# EAGLE design RS9113-XXX-X1X Breakout (EAGLE 6.6.0)
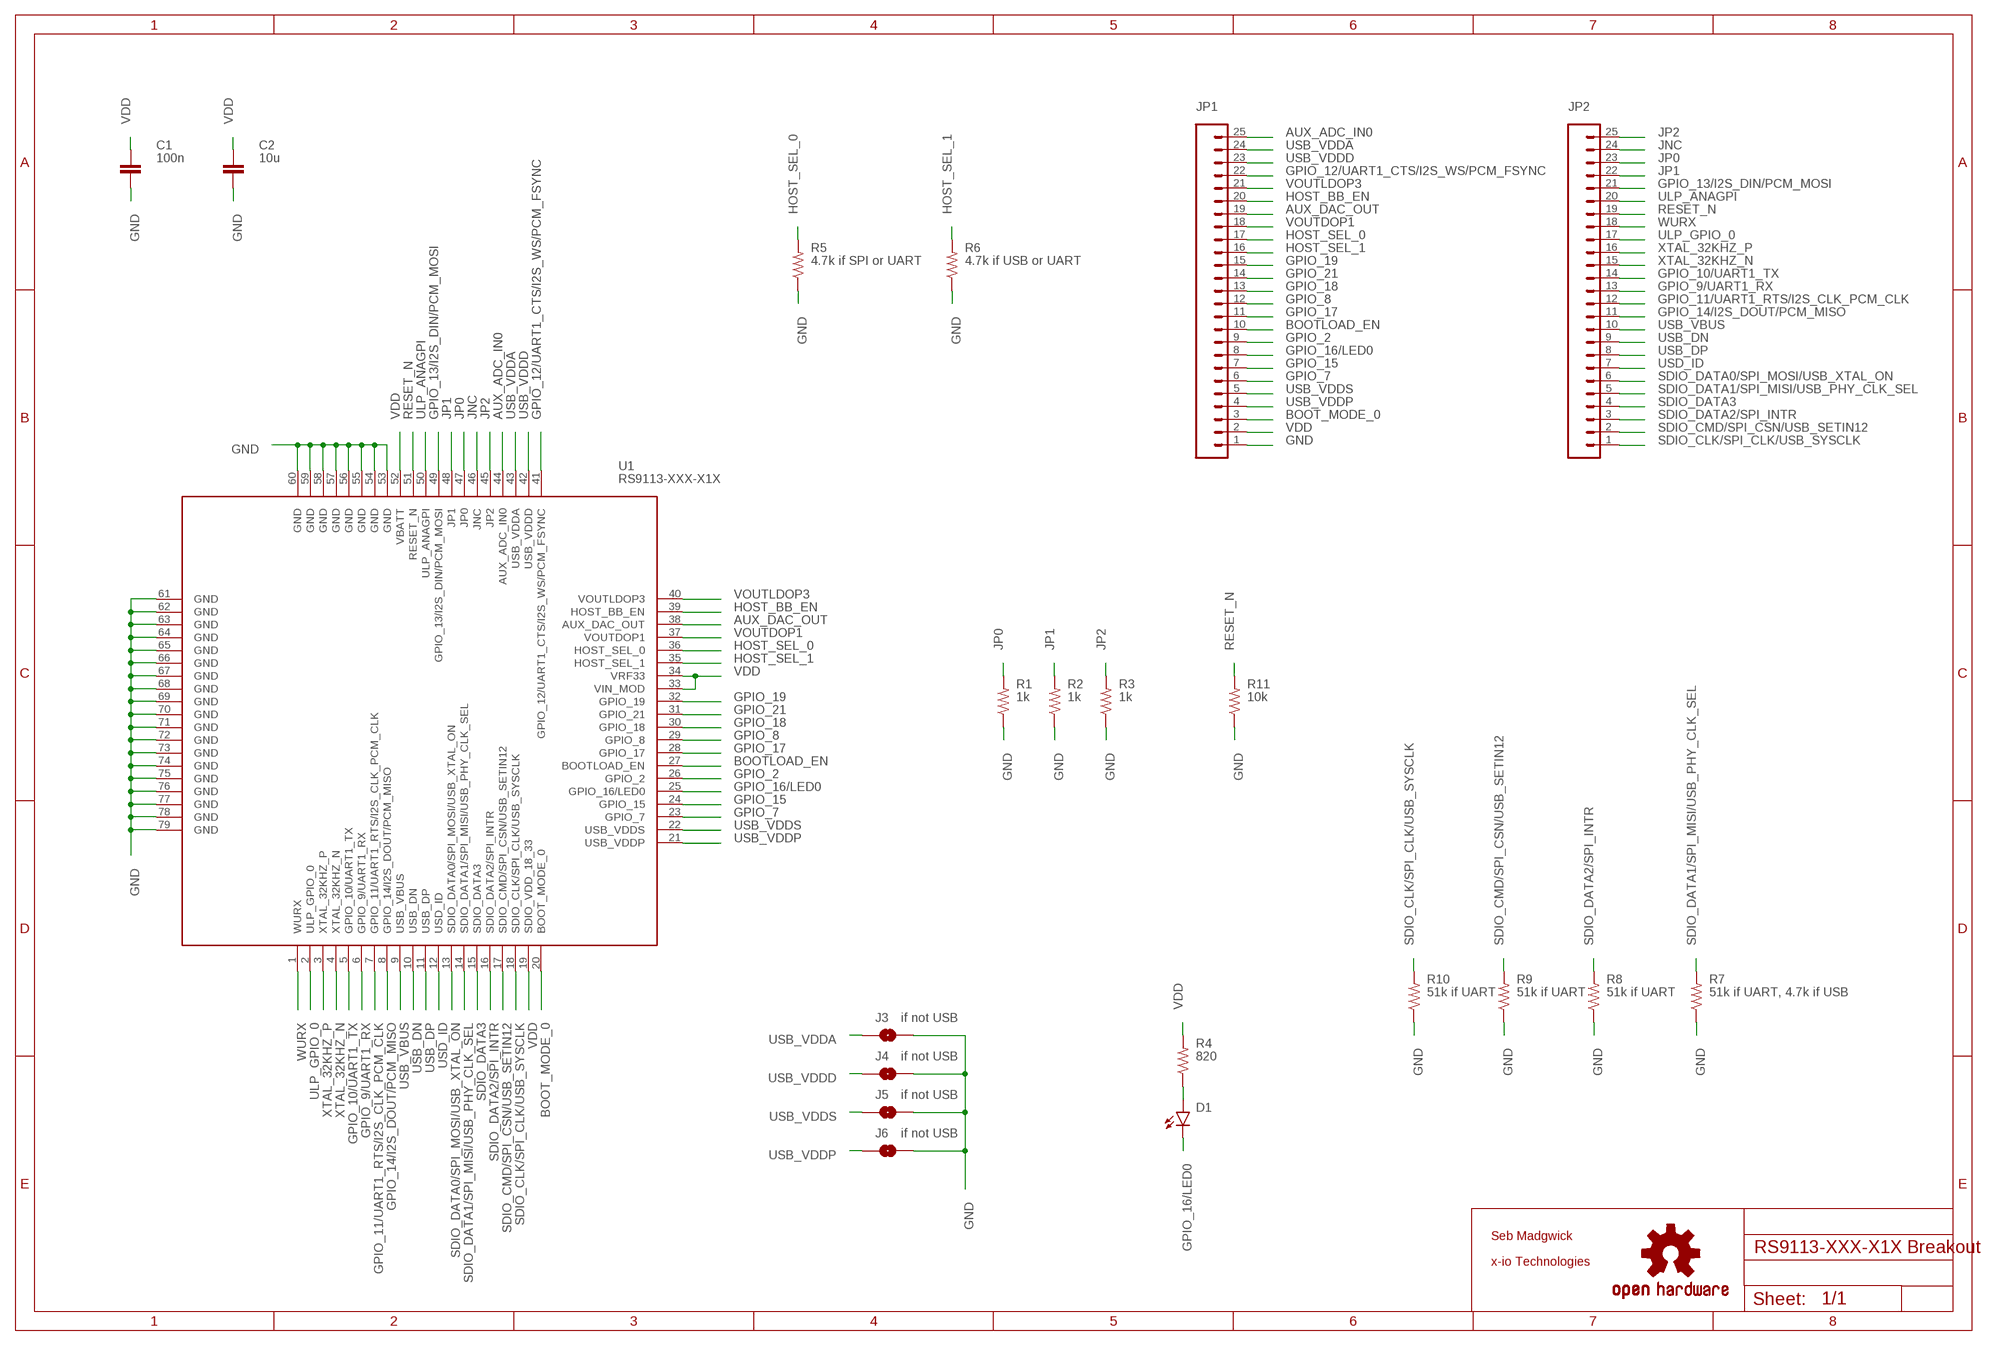
[diagram p0: schematic, sheet 1]

## Parts
C1  100n  CAP0603-CAP  [0603-CAP]
C2  10u  CAP0603-CAP  [0603-CAP]
D1  GREEN  LED-GREEN0603  [LED-0603]
J3  if not USB  SOLDERJUMPERNO  [SJ_2S-NO]
J4  if not USB  SOLDERJUMPERNO  [SJ_2S-NO]
J5  if not USB  SOLDERJUMPERNO  [SJ_2S-NO]
J6  if not USB  SOLDERJUMPERNO  [SJ_2S-NO]
JP1  M25PTH  [1X25]
JP2  M25PTH  [1X25]
LOGO1  OSHW-LOGOS  [OSHW-LOGO-S]
R1  1k  RESISTOR0603  [0603-RES]
R2  1k  RESISTOR0603  [0603-RES]
R3  1k  RESISTOR0603  [0603-RES]
R4  820  RESISTOR0603  [0603-RES]
R5  4.7k if SPI or UART  RESISTOR0603  [0603-RES]
R6  4.7k if USB or UART  RESISTOR0603  [0603-RES]
R7  51k if UART, 4.7k if USB  RESISTOR0603  [0603-RES]
R8  51k if UART  RESISTOR0603  [0603-RES]
R9  51k if UART  RESISTOR0603  [0603-RES]
R10  51k if UART  RESISTOR0603  [0603-RES]
R11  10k  RESISTOR0603  [0603-RES]
U1  RS9113-XXX-X1X  [RS9113-XXX-X1X]

## Nets
AUX_ADC_IN0: JP1.25 U1.44(AUX_ADC_IN0)
AUX_DAC_OUT: JP1.19 U1.38(AUX_DAC_OUT)
BOOT_MODE_0: JP1.3 U1.20(BOOT_MODE_0)
BOOTLOAD_EN: JP1.10 U1.27(BOOTLOAD_EN)
GND: C1.2 C2.2 J3.1 J4.1 J5.1 J6.1 JP1.1 R1.1 R2.1 R3.1 R5.1 R6.1 R7.1 R8.1 R9.1 R10.1 R11.1 U1.53(GND) U1.54(GND) U1.55(GND) U1.56(GND) U1.57(GND) U1.58(GND) U1.59(GND) U1.60(GND) U1.61(GND) U1.62(GND) U1.63(GND) U1.64(GND) U1.65(GND) U1.66(GND) U1.67(GND) U1.68(GND) U1.69(GND) U1.70(GND) U1.71(GND) U1.72(GND) U1.73(GND) U1.74(GND) U1.75(GND) U1.76(GND) U1.77(GND) U1.78(GND) U1.79(GND)
GPIO_2: JP1.9 U1.26(GPIO_2)
GPIO_7: JP1.6 U1.23(GPIO_7)
GPIO_8: JP1.12 U1.29(GPIO_8)
GPIO_9/UART1_RX: JP2.13 U1.6(GPIO_9/UART1_RX)
GPIO_10/UART1_TX: JP2.14 U1.5(GPIO_10/UART1_TX)
GPIO_11/UART1_RTS/I2S_CLK_PCM_CLK: JP2.12 U1.7(GPIO_11/UART1_RTS/I2S_CLK_PCM_CLK)
GPIO_12/UART1_CTS/I2S_WS/PCM_FSYNC: JP1.22 U1.41(GPIO_12/UART1_CTS/I2S_WS/PCM_FSYNC)
GPIO_13/I2S_DIN/PCM_MOSI: JP2.21 U1.49(GPIO_13/I2S_DIN/PCM_MOSI)
GPIO_14/I2S_DOUT/PCM_MISO: JP2.11 U1.8(GPIO_14/I2S_DOUT/PCM_MISO)
GPIO_15: JP1.7 U1.24(GPIO_15)
GPIO_16/LED0: D1.C JP1.8 U1.25(GPIO_16/LED0)
GPIO_17: JP1.11 U1.28(GPIO_17)
GPIO_18: JP1.13 U1.30(GPIO_18)
GPIO_19: JP1.15 U1.32(GPIO_19)
GPIO_21: JP1.14 U1.31(GPIO_21)
HOST_BB_EN: JP1.20 U1.39(HOST_BB_EN)
HOST_SEL_0: JP1.17 R5.2 U1.36(HOST_SEL_0)
HOST_SEL_1: JP1.16 R6.2 U1.35(HOST_SEL_1)
JNC: JP2.24 U1.46(JNC)
JP0: JP2.23 R1.2 U1.47(JP0)
JP1: JP2.22 R2.2 U1.48(JP1)
JP2: JP2.25 R3.2 U1.45(JP2)
N$1: D1.A R4.1
RESET_N: JP2.19 R11.2 U1.51(RESET_N)
SDIO_CLK/SPI_CLK/USB_SYSCLK: JP2.1 R10.2 U1.18(SDIO_CLK/SPI_CLK/USB_SYSCLK)
SDIO_CMD/SPI_CSN/USB_SETIN12: JP2.2 R9.2 U1.17(SDIO_CMD/SPI_CSN/USB_SETIN12)
SDIO_DATA0/SPI_MOSI/USB_XTAL_ON: JP2.6 U1.13(SDIO_DATA0/SPI_MOSI/USB_XTAL_ON)
SDIO_DATA1/SPI_MISI/USB_PHY_CLK_SEL: JP2.5 R7.2 U1.14(SDIO_DATA1/SPI_MISI/USB_PHY_CLK_SEL)
SDIO_DATA2/SPI_INTR: JP2.3 R8.2 U1.16(SDIO_DATA2/SPI_INTR)
SDIO_DATA3: JP2.4 U1.15(SDIO_DATA3)
ULP_ANAGPI: JP2.20 U1.50(ULP_ANAGPI)
ULP_GPIO_0: JP2.17 U1.2(ULP_GPIO_0)
USB_DN: JP2.9 U1.10(USB_DN)
USB_DP: JP2.8 U1.11(USB_DP)
USB_VBUS: JP2.10 U1.9(USB_VBUS)
USB_VDDA: J3.2 JP1.24 U1.43(USB_VDDA)
USB_VDDD: J4.2 JP1.23 U1.42(USB_VDDD)
USB_VDDP: J6.2 JP1.4 U1.21(USB_VDDP)
USB_VDDS: J5.2 JP1.5 U1.22(USB_VDDS)
USD_ID: JP2.7 U1.12(USD_ID)
VDD: C1.1 C2.1 JP1.2 R4.2 U1.19(SDIO_VDD_18_33) U1.33(VIN_MOD) U1.34(VRF33) U1.52(VBATT)
VOUTDOP1: JP1.18 U1.37(VOUTDOP1)
VOUTLDOP3: JP1.21 U1.40(VOUTLDOP3)
WURX: JP2.18 U1.1(WURX)
XTAL_32KHZ_N: JP2.15 U1.4(XTAL_32KHZ_N)
XTAL_32KHZ_P: JP2.16 U1.3(XTAL_32KHZ_P)

## Notes on the sheet
- Seb Madgwick
- x-io Technologies

## Library data of the parts
C1 C2 = SparkFun-Capacitors:CAP: Capacitor Standard 0603 ceramic capacitor, and 0.1" leaded capacitor.
D1 = SparkFun-LED:LED-GREEN: Various green LEDs Green LEDs used in SFE Production 0603- DIO-00821 LARGE- DIO-00862 LILYPAD- DIO-09910; PROD_ID: DIO-00821
J3-J6 = SparkFun-Retired:SOLDERJUMPER: Solder Jumper Standard SMD solder jumper. Used to automate production. Two varients : Normally Open and Normally Closed are the same, but have different paste layers. NC will have a large amount of paste and should jumper during reflow.
JP1 JP2 = SparkFun-Connectors:M25: 1x25 .1" header
LOGO1 = SparkFun-Aesthetics:OSHW-LOGO: Open Source Hardware Logo This logo indicates the piece of hardware it is found on incorporates a OSHW license and/or adheres to the definition of open source hardware found here: http://freedomdefined.org/OSHW
R1-R11 = SparkFun-Resistors:RESISTOR: Resistor Basic schematic elements and footprints for 0603, 1206, and PTH resistors.
U1 = x-io:RS9113-XXX-X1X

## Board
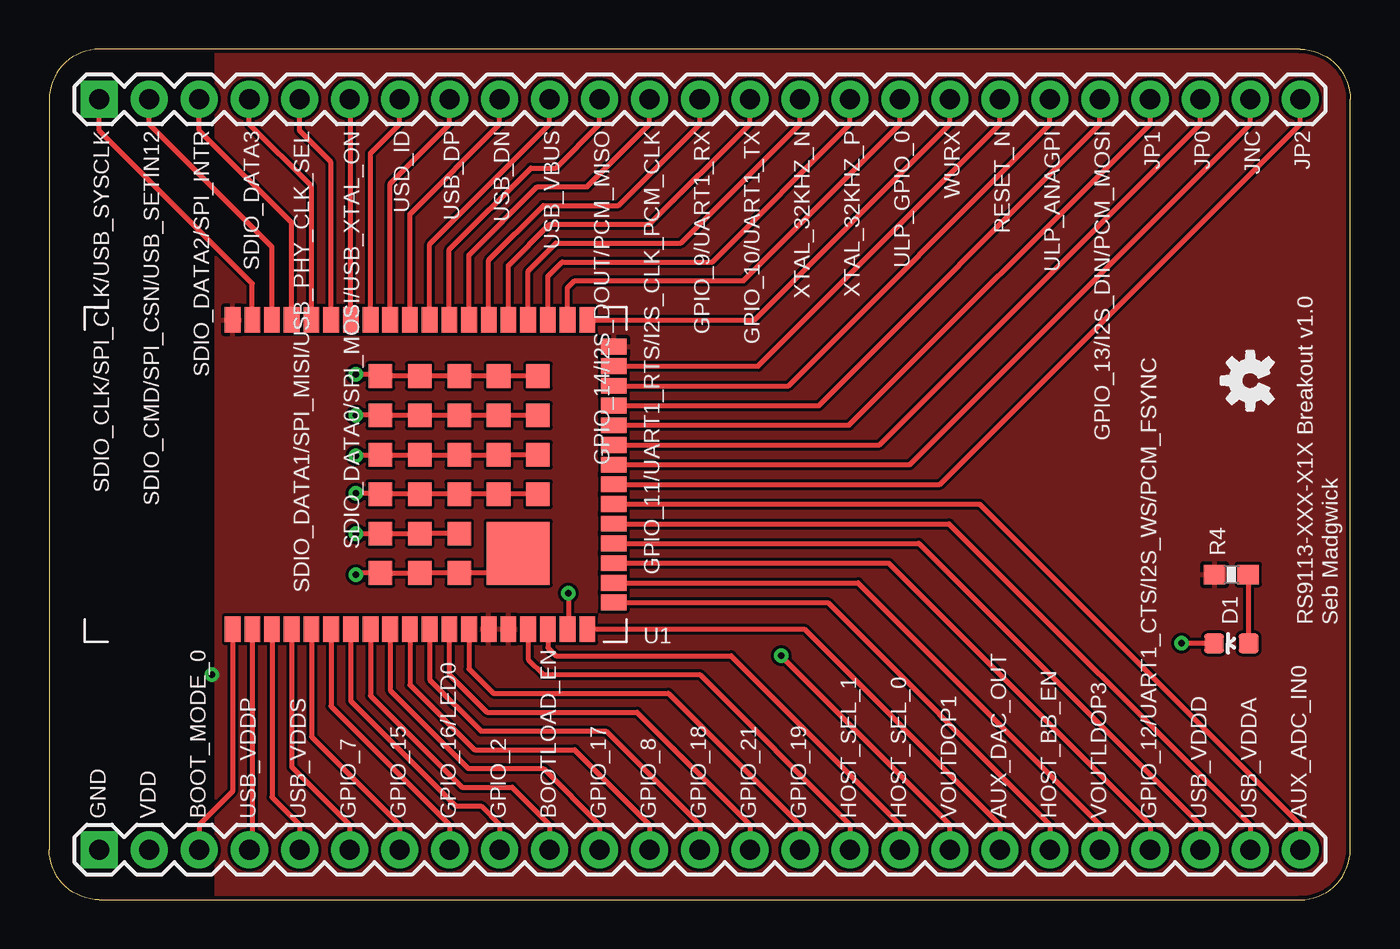
[diagram p1: board, top side]
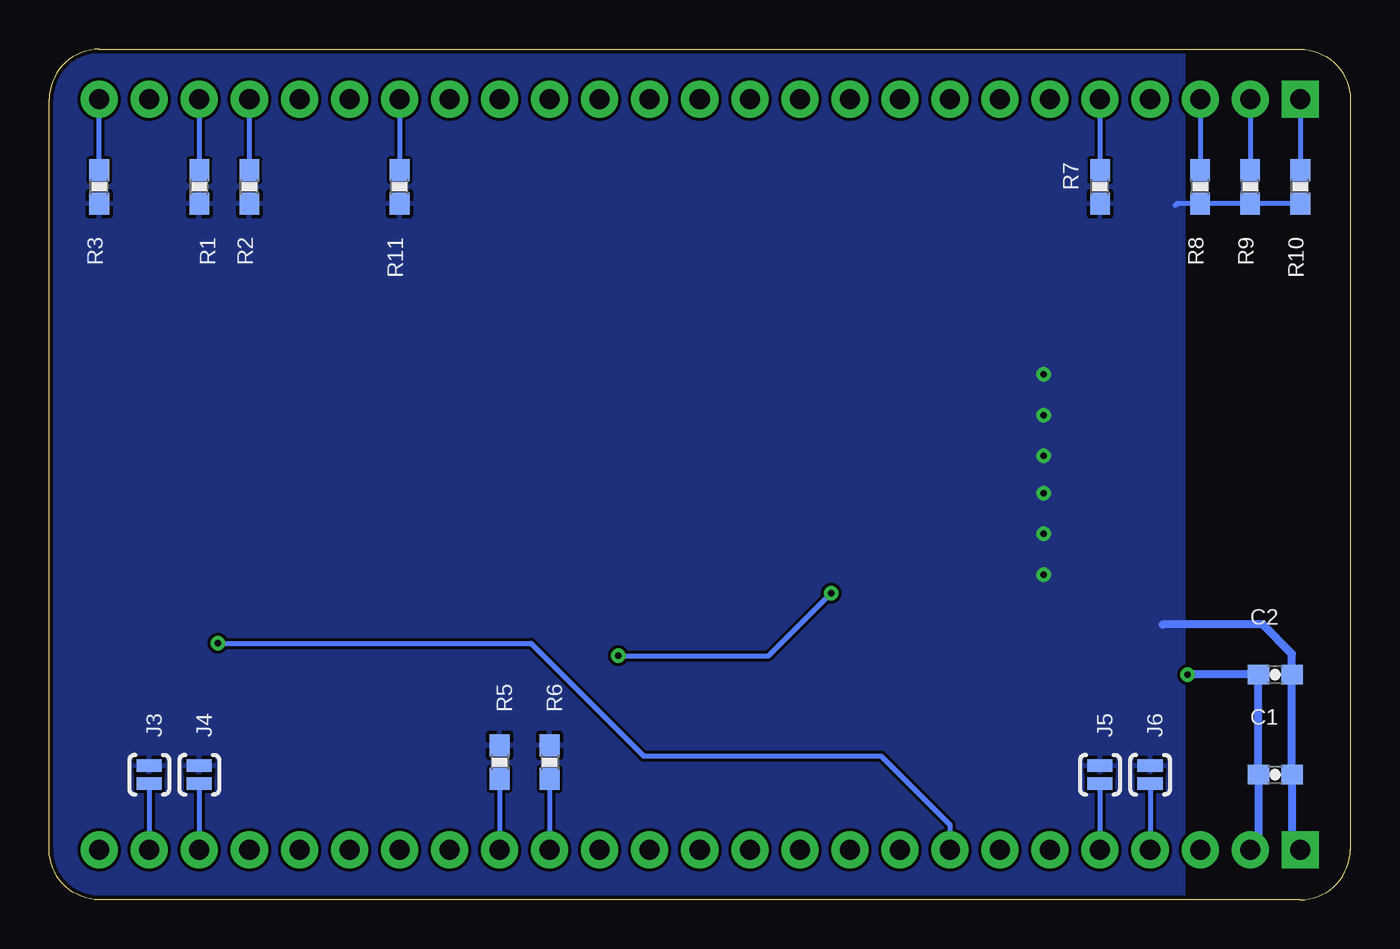
[diagram p2: board, bottom side, seen from below]

Size 66.04 x 43.18 mm. Coordinates in mm from the lower left corner, seen from the top.
Outline: 2.54,0 63.5,0 arc90 66.04,2.54 66.04,40.64 arc90 63.5,43.18 2.54,43.18 arc90 0,40.64 0,2.54 arc90 2.54,0
Copper layers (1*16): Top 0.035mm / dielectric 1.5mm / Bottom 0.035mm
Design rules "default *": minimum track width 6mil, minimum drill 13mil, track to track 6mil, track to pad 6mil, pad to pad 6mil, via to via 6mil, smd to smd 0.15mm, copper to edge 0.2mm, drill to drill 0.15mm, minimum pad ring 10mil, minimum via ring 8mil, stop-mask expansion 4mil, vias tented up to drill 1mm, thermal gap 0.195mm
tRestrict: area 0,0 to 8.3,43.2
bRestrict: area 0,0 to 8.3,43.2

### Footprints (pad centres in the part's own frame; a part is rotated, then mirrored left to right if it is on the bottom)
0603-CAP = smd 1.1 x 1: 1 -0.85,0; 2 0.85,0
LED-0603 = smd 1 x 1: A 0,-0.877; C 0,0.877
SJ_2S-NO = smd 0.635 x 1.27: 1 -0.45,0; 2 0.45,0
1X25 = drill 1.016 pad 1.88 square: 1 0,0 | drill 1.016 pad 1.88: 2 2.54,0; 3 5.08,0; 4 7.62,0; 5 10.16,0; 6 12.7,0; 7 15.24,0; 8 17.78,0; 9 20.32,0; 10 22.86,0; 11 25.4,0; 12 27.94,0; 13 30.48,0; 14 33.02,0; 15 35.56,0; 16 38.1,0; 17 40.64,0; 18 43.18,0; 19 45.72,0; 20 48.26,0; 21 50.8,0; 22 53.34,0; 23 55.88,0; 24 58.42,0; 25 60.96,0
0603-RES = smd 1.1 x 1: 1 -0.85,0; 2 0.85,0
RS9113-XXX-X1X = smd 1.3 x 0.8: 1 7.85,-11.75; 2 7.85,-10.75; 3 7.85,-9.75; 4 7.85,-8.75; 5 7.85,-7.75; 6 7.85,-6.75; 7 7.85,-5.75; 8 7.85,-4.75; 9 7.85,-3.75; 10 7.85,-2.75; 11 7.85,-1.75; 12 7.85,-0.75; 13 7.85,0.25; 14 7.85,1.25; 15 7.85,2.25; 16 7.85,3.25; 17 7.85,4.25; 18 7.85,5.25; 19 7.85,6.25; 20 -7.85,6.25; 21 -7.85,5.25; 22 -7.85,4.25; 23 -7.85,3.25; 24 -7.85,2.25; 25 -7.85,1.25; 26 -7.85,0.25; 27 -7.85,-0.75; 28 -7.85,-1.75; 29 -7.85,-2.75; 30 -7.85,-3.75; 31 -7.85,-4.75; 32 -7.85,-5.75; 33 -7.85,-6.75; 34 -7.85,-7.75; 35 -7.85,-8.75; 36 -7.85,-9.75; 37 -7.85,-10.75; 38 -7.85,-11.75 | smd 0.8 x 1.3: 39 -6.5,-13.1; 40 -5.5,-13.1; 41 -4.5,-13.1; 42 -3.5,-13.1; 43 -2.5,-13.1; 44 -1.5,-13.1; 45 -0.5,-13.1; 46 0.5,-13.1; 47 1.5,-13.1; 48 2.5,-13.1; 49 3.5,-13.1; 50 4.5,-13.1; 51 5.5,-13.1; 52 6.5,-13.1 | smd 3.2 x 3.2: 53 -4,-8.25 | smd 1.2 x 1.2: 54 -1,-9.25; 55 1,-9.25; 56 3,-9.25; 57 5,-9.25; 58 -1,-7.25; 59 1,-7.25; 60 3,-7.25; 61 5,-7.25; 62 -5,-5.25; 63 -3,-5.25; 64 -1,-5.25; 65 1,-5.25; 66 3,-5.25; 67 5,-5.25; 68 -5,-3.25; 69 -3,-3.25; 70 -1,-3.25; 71 1,-3.25; 72 3,-3.25; 73 5,-3.25; 74 -5,-1.25; 75 -3,-1.25; 76 -1,-1.25; 77 1,-1.25; 78 3,-1.25; 79 5,-1.25

### Placement (x,y rotation side)
C1  3.81,6.35 0 bottom
C2  3.81,11.43 0 bottom
D1  60.01,13.02 90 top
J3  60.96,6.35 270 bottom
J4  58.42,6.35 270 bottom
J5  12.7,6.35 270 bottom
J6  10.16,6.35 270 bottom
JP1  2.54,2.54 0 top
JP2  2.54,40.64 0 top
LOGO1  60.96,26.35 90 top
R1  58.42,36.2 90 bottom
R2  55.88,36.2 90 bottom
R3  63.5,36.2 90 bottom
R4  60.01,16.51 180 top
R5  43.18,6.99 270 bottom
R6  40.64,6.99 270 bottom
R7  12.7,36.2 90 bottom
R8  7.62,36.2 90 bottom
R9  5.08,36.2 90 bottom
R10  2.54,36.2 90 bottom
R11  48.26,36.2 90 bottom
U1  15.56,21.59 90 top

### Tracks (layer width: path | path; a pad name or v marks a point on that pad's centre or on a via)
AUX_ADC_IN0
  Top 0.254: U1.44 47.22,20.09 63.5,3.81 JP1.25
AUX_DAC_OUT
  Top 0.254: U1.38 38.33,13.74 48.26,3.81 JP1.19
BOOT_MODE_0
  Top 0.254: U1.20 9.31,5.5 7.62,3.81 JP1.3
BOOTLOAD_EN
  Top 0.254: U1.27 16.31,10.36 20.95,5.71 23.5,5.71 25.4,3.81 JP1.10
GND  (via drill 0.33)
  Top 0.254: v15.56,16.51 15.56,16.59 U1.74 U1.68 U1.62 22.81,16.59 U1.53 | U1.63 U1.69 U1.75 16.79,18.57 v15.56,18.57 | v15.56,20.64 16.76,20.64 U1.76 U1.70 U1.64 U1.58 U1.54 | U1.55 U1.59 U1.65 U1.71 U1.77 16.76,22.54 v15.56,22.54 | v15.56,24.61 16.79,24.61 U1.78 U1.72 U1.66 U1.60 U1.56 | U1.57 U1.61 U1.67 U1.73 U1.79 16.73,26.67 v15.56,26.67
  Bottom 0.254: R10.1 R9.1 R8.1 8.79,35.34 8.89,35.24
  Bottom 0.406: C1.2 2.96,2.96 JP1.1 | C1.2 C2.2 | C1.2 2.96,12.48 4.45,13.97 9.53,13.97
  pour Bottom: 0,43.18 66.04,43.18 66.04,0 0,0
GPIO_2
  Top 0.254: U1.26 15.31,10.09 20.64,4.76 21.91,4.76 22.86,3.81 JP1.9
GPIO_7
  Top 0.254: U1.23 12.31,6.74 15.24,3.81 JP1.6
GPIO_8
  Top 0.254: U1.29 18.31,10.9 21.59,7.62 26.67,7.62 30.48,3.81 JP1.12
GPIO_9/UART1_RX
  Top 0.254: U1.6 22.31,32.47 25.08,35.24 28.89,35.24 33.02,39.37 JP2.13
GPIO_10/UART1_TX
  Top 0.254: U1.5 23.31,32.2 25.4,34.29 30.48,34.29 35.56,39.37 JP2.14
GPIO_11/UART1_RTS/I2S_CLK_PCM_CLK
  Top 0.254: U1.7 21.31,32.74 24.77,36.2 27.3,36.2 30.48,39.37 JP2.12
GPIO_12/UART1_CTS/I2S_WS/PCM_FSYNC
  Top 0.254: U1.41 42.6,17.09 55.88,3.81 JP1.22
GPIO_13/I2S_DIN/PCM_MOSI
  Top 0.254: U1.49 39.06,25.09 53.34,39.37 JP2.21
GPIO_14/I2S_DOUT/PCM_MISO
  Top 0.254: U1.8 20.31,33.01 24.45,37.15 25.72,37.15 27.94,39.37 JP2.11
GPIO_15
  Top 0.254: U1.24 13.31,8.28 17.78,3.81 JP1.7
GPIO_16/LED0  (via drill 0.33)
  Top 0.254: JP1.8 20.32,3.81 14.31,9.82 U1.25 | D1.C v57.47,13.02
  Bottom 0.254: v57.47,13.02 41.59,13.02 35.88,7.3 23.81,7.3 20.32,3.81 JP1.8
GPIO_17
  Top 0.254: U1.28 17.31,10.63 21.27,6.67 25.08,6.67 27.94,3.81 JP1.11
GPIO_18
  Top 0.254: U1.30 19.31,11.17 21.91,8.57 28.26,8.57 33.02,3.81 JP1.13
GPIO_19
  Top 0.254: U1.32 21.31,11.71 22.54,10.48 31.43,10.48 38.1,3.81 JP1.15
GPIO_21
  Top 0.254: U1.31 20.31,11.44 22.23,9.53 29.84,9.53 35.56,3.81 JP1.14
HOST_BB_EN
  Top 0.254: U1.39 39.52,15.09 50.8,3.81 JP1.20
HOST_SEL_0
  Top 0.254: U1.36 25.31,12.79 25.72,12.38 34.61,12.38 43.18,3.81 JP1.17
  Bottom 0.254: R5.2 JP1.17
HOST_SEL_1
  Top 0.254: U1.35 24.31,12.21 25.08,11.43 33.02,11.43 40.64,3.81 JP1.16
  Bottom 0.254: R6.2 JP1.16
JNC
  Top 0.254: U1.46 43.68,22.09 60.96,39.37 JP2.24
JP0
  Top 0.254: U1.47 42.14,23.09 58.42,39.37 JP2.23
  Bottom 0.254: JP2.23 R1.2
JP1
  Top 0.254: U1.48 40.6,24.09 55.88,39.37 JP2.22
  Bottom 0.254: JP2.22 R2.2
JP2
  Top 0.254: U1.45 45.22,21.09 63.5,39.37 JP2.25
  Bottom 0.254: R3.2 JP2.25
N$1
  Top 0.254: R4.1 60.86,13.04 D1.A
RESET_N
  Top 0.254: U1.51 35.98,27.09 48.26,39.37 JP2.19
  Bottom 0.254: JP2.19 R11.2
SDIO_CLK/SPI_CLK/USB_SYSCLK
  Top 0.254: U1.18 10.31,31.29 2.54,39.05 JP2.1
  Bottom 0.254: JP2.1 R10.2
SDIO_CMD/SPI_CSN/USB_SETIN12
  Top 0.254: U1.17 11.31,33.14 5.08,39.37 JP2.2
  Bottom 0.254: JP2.2 R9.2
SDIO_DATA0/SPI_MOSI/USB_XTAL_ON
  Top 0.254: U1.13 15.31,40.57 JP2.6
SDIO_DATA1/SPI_MISI/USB_PHY_CLK_SEL
  Top 0.254: U1.14 14.31,37.45 12.7,39.05 JP2.5
  Bottom 0.254: JP2.5 R7.2
SDIO_DATA2/SPI_INTR
  Top 0.254: U1.16 12.31,34.37 7.62,39.05 JP2.3
  Bottom 0.254: JP2.3 R8.2
SDIO_DATA3
  Top 0.254: U1.15 13.31,36.22 10.16,39.37 JP2.4
ULP_ANAGPI
  Top 0.254: U1.50 37.52,26.09 50.8,39.37 JP2.20
ULP_GPIO_0
  Top 0.254: U1.2 26.31,31.07 26.67,31.43 35.24,31.43 43.18,39.37 JP2.17
USB_DN
  Top 0.254: U1.10 18.31,34.82 22.86,39.37 JP2.9
USB_DP
  Top 0.254: U1.11 17.31,36.36 20.32,39.37 JP2.8
USB_VBUS
  Top 0.254: U1.9 19.31,33.28 25.4,39.37 JP2.10
USB_VDDA
  Top 0.254: U1.43 45.68,19.09 60.96,3.81 JP1.24
  Bottom 0.254: J3.2 JP1.24
USB_VDDD
  Top 0.254: U1.42 44.14,18.09 58.42,3.81 JP1.23
  Bottom 0.254: J4.2 JP1.23
USB_VDDP
  Top 0.254: U1.21 10.31,2.69 JP1.4
  Bottom 0.254: J6.2 JP1.4
USB_VDDS
  Top 0.254: U1.22 11.31,5.2 12.7,3.81 JP1.5
  Bottom 0.254: J5.2 JP1.5
USD_ID
  Top 0.254: U1.12 16.31,37.9 17.78,39.37 JP2.7
VDD  (via drill 0.33)
  Bottom 0.406: JP1.2 4.66,2.96 C1.1 C2.1 v8.26,11.43
  pour Top: 0,43.18 66.04,43.18 66.04,0 0,0
VOUTDOP1  (via drill 0.33)
  Top 0.254: JP1.18 45.72,3.81 v37.15,12.38 | v26.35,15.56 26.35,13.79 U1.37
  Bottom 0.254: v37.15,12.38 29.53,12.38 v26.35,15.56
VOUTLDOP3
  Top 0.254: U1.40 41.06,16.09 53.34,3.81 JP1.21
WURX
  Top 0.254: U1.1 35.79,29.44 45.72,39.37 JP2.18
XTAL_32KHZ_N
  Top 0.254: U1.4 24.31,31.93 25.72,33.34 32.07,33.34 38.1,39.37 JP2.15
XTAL_32KHZ_P
  Top 0.254: U1.3 25.31,31.66 26.04,32.38 33.66,32.38 40.64,39.37 JP2.16

### Text on the board
_tsilk: SDIO_CLK/SPI_CLK/USB_SYSCLK | SDIO_CMD/SPI_CSN/USB_SETIN12 | SDIO_DATA2/SPI_INTR | SDIO_DATA3 | SDIO_DATA1/SPI_MISI/USB_PHY_CLK_SEL | SDIO_DATA0/SPI_MOSI/USB_XTAL_ON | USD_ID | USB_DP | USB_DN | USB_VBUS | GPIO_14/I2S_DOUT/PCM_MISO | GPIO_11/UART1_RTS/I2S_CLK_PCM_CLK | GPIO_9/UART1_RX | GPIO_10/UART1_TX | XTAL_32KHZ_N | XTAL_32KHZ_P | ULP_GPIO_0 | WURX | RESET_N | ULP_ANAGPI | GPIO_13/I2S_DIN/PCM_MOSI | JP1 | JP0 | JNC | JP2 | RS9113-XXX-X1X Breakout v1.0 | Seb Madgwick | GND | VDD | BOOT_MODE_0 | USB_VDDP | USB_VDDS | GPIO_7 | GPIO_15 | GPIO_16/LED0 | GPIO_2 | BOOTLOAD_EN | GPIO_17 | GPIO_8 | GPIO_18 | GPIO_21 | GPIO_19 | HOST_SEL_1 | HOST_SEL_0 | VOUTDOP1 | AUX_DAC_OUT | HOST_BB_EN | VOUTLDOP3 | GPIO_12/UART1_CTS/I2S_WS/PCM_FSYNC | USB_VDDD | USB_VDDA | AUX_ADC_IN0